# EAGLE design HeadsetR2 (EAGLE 6.5.0)
ECE477 Senior Design Project Augmented Reality Simulator board utilizing STM32F4 and Raspberry PI
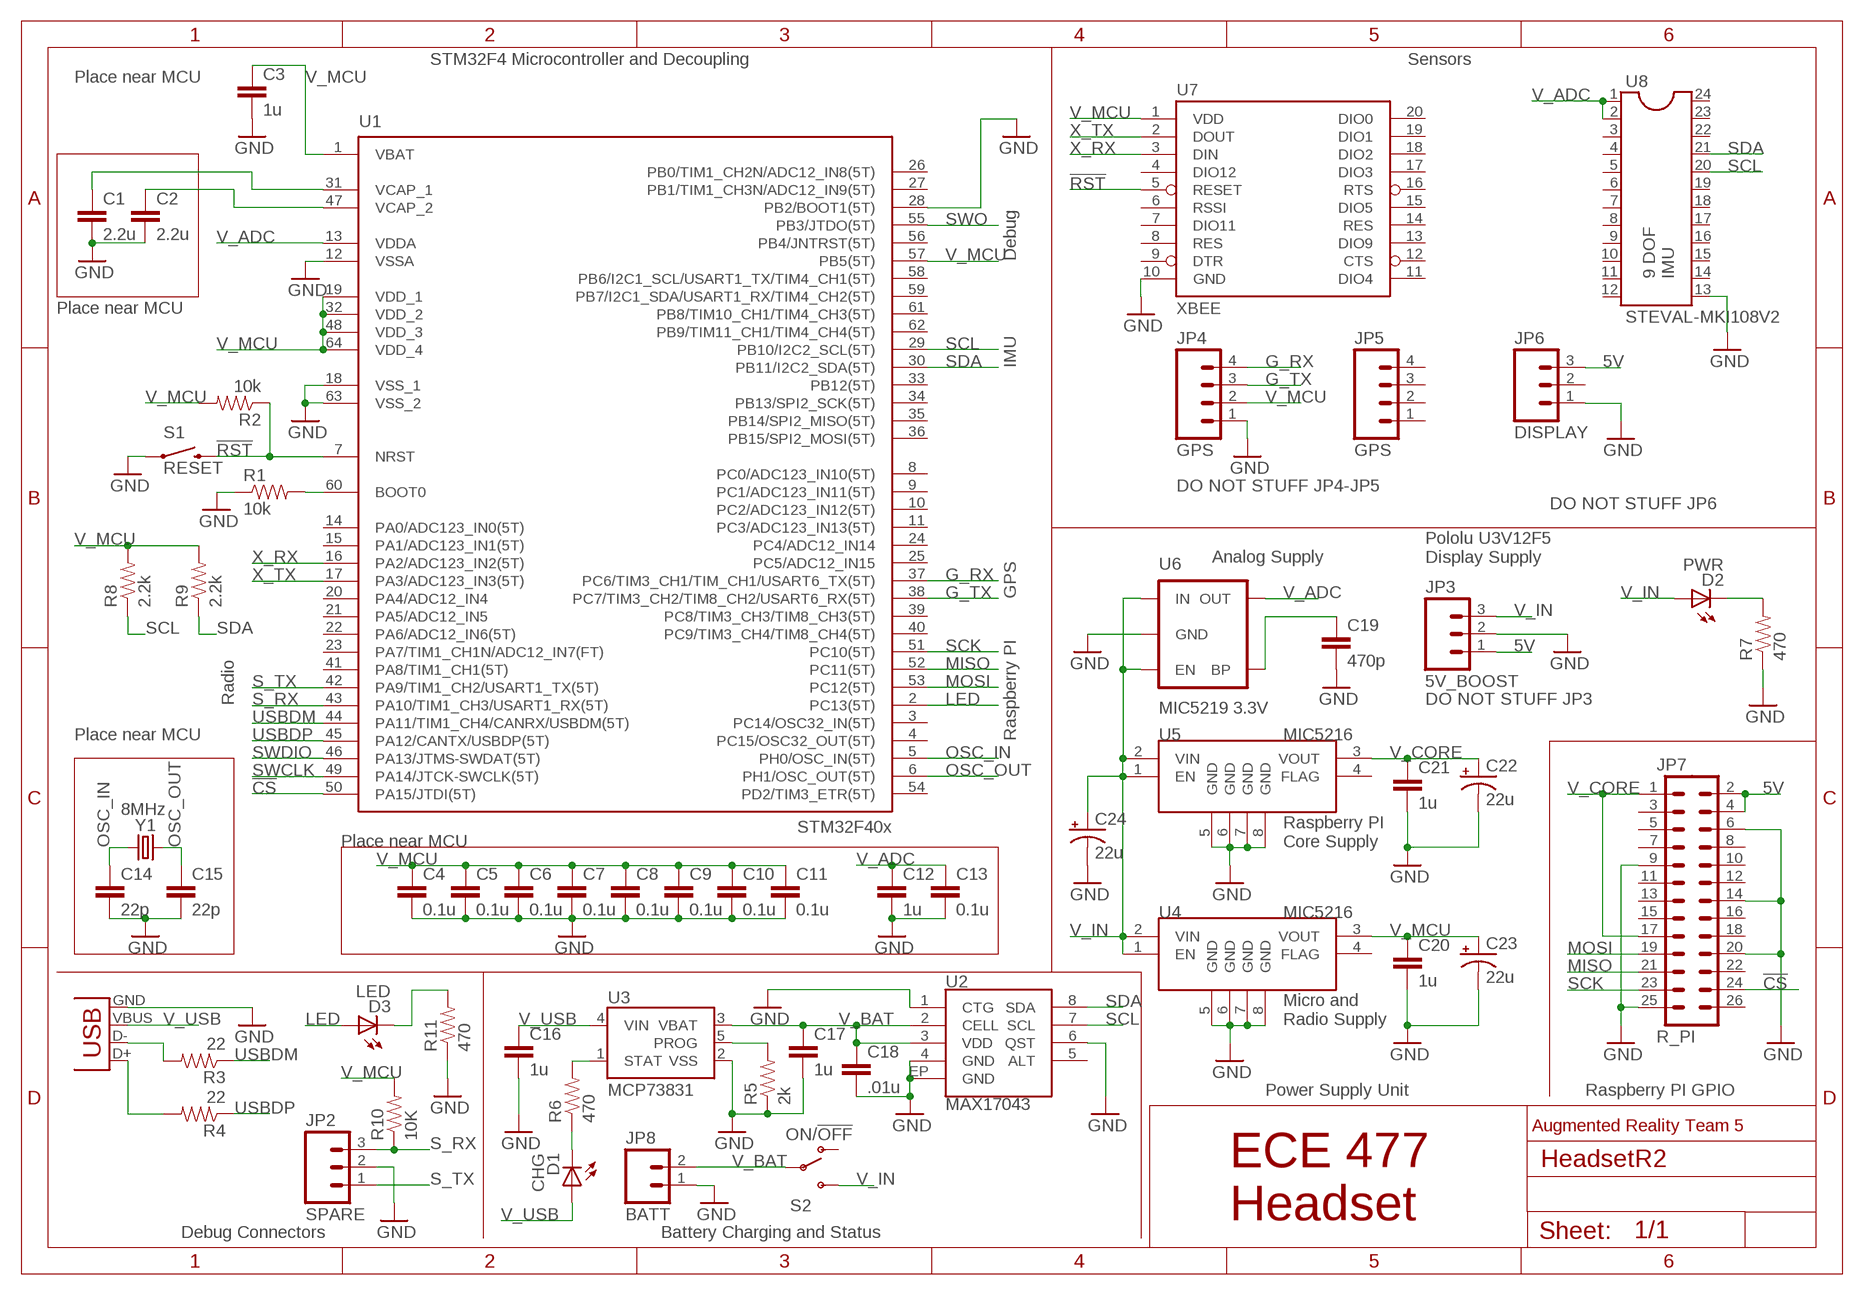
[diagram p0: schematic, sheet 1]

## Parts
C1  2.2u  CAP1206  [1206]
C2  2.2u  CAP1206  [1206]
C3  1u  CAP1206  [1206]
C4  0.1u  CAP1206  [1206]
C5  0.1u  CAP1206  [1206]
C6  0.1u  CAP1206  [1206]
C7  0.1u  CAP1206  [1206]
C8  0.1u  CAP1206  [1206]
C9  0.1u  CAP1206  [1206]
C10  0.1u  CAP1206  [1206]
C11  0.1u  CAP1206  [1206]
C12  1u  CAP1206  [1206]
C13  0.1u  CAP1206  [1206]
C14  22p  CAP1206  [1206]
C15  22p  CAP1206  [1206]
C16  1u  CAP1206  [1206]
C17  1u  CAP1206  [1206]
C18  .01u  CAP1206  [1206]
C19  470p  CAP1206  [1206]
C20  1u  CAP1206  [1206]
C21  1u  CAP1206  [1206]
C22  22u  CAP_POLD  [PANASONIC_D]
C23  22u  CAP_POLD  [PANASONIC_D]
C24  22u  CAP_POLD  [PANASONIC_D]
D1  CHG  LED-RED1206  [LED-1206]
D2  PWR  LED-RED1206  [LED-1206]
D3  LED  LED-RED1206  [LED-1206]
JP1  USBSMD  [USB-MINIB]
JP2  SPARE  M03PTH  [1X03]
JP3  5V_BOOST  M03PTH  [1X03]
JP4  GPS  M04PTH  [1X04]
JP5  GPS  M04PTH  [1X04]
JP6  DISPLAY  M03PTH  [1X03]
JP7  R_PI  M13X22X13  [2X13]
JP8  BATT  M02JST-PTH-2  [JST-2-PTH]
R1  10k  RES1206  [1206]
R2  10k  RES1206  [1206]
R3  22  RES1206  [1206]
R4  22  RES1206  [1206]
R5  2k  RES1206  [1206]
R6  470  RES1206  [1206]
R7  470  RES1206  [1206]
R8  2.2k  RES1206  [1206]
R9  2.2k  RES1206  [1206]
R10  10K  RES1206  [1206]
R11  470  RES1206  [1206]
S1  RESET  SWITCH-MOMENTARY-2PTH  [TACTILE-PTH]
S2  ON/!OFF!  SWITCH-SPDTPTH  [SWITCH-SPDT]
U1  STM32F405RGT6  STM32F405R  [TQFP64]
U2  MAX17043  MAX1704X  [TDFN-8]
U3  MCP73831  [SOT23-5]
U4  MIC5216  V_REG_MIC5216  [MSOP8]
U5  MIC5216  V_REG_MIC5216  [MSOP8]
U6  MIC5219 3.3V  V_REG_MIC52193.3V  [SOT23-5]
U7  XBEE  XBEE-1B1  [XBEE-1]
U8  STEVAL-MKI108V2  DIL24-6  [DIL24-6]
Y1  8MHz  CRYSTALSMD  [HC49UP]

## Nets
5V: JP3.1 JP6.3 JP7.2 JP7.4
!CS!: JP7.24 U1.50(PA15/JTDI(5T))
!RST!: R2.1 S1.3 U1.7(NRST) U7.5(RESET)
BC_PROG: R5.2 U3.5(PROG)
BC_STAT: R6.2 U3.1(STAT)
BC_STAT_LED: D1.C R6.1
BOOT0: R1.2 U1.60(BOOT0)
G_RX: JP4.4 U1.37(PC6/TIM3_CH1/TIM_CH1/USART6_TX(5T))
G_TX: JP4.3 U1.38(PC7/TIM3_CH2/TIM8_CH2/USART6_RX(5T))
GND: C1.2 C2.2 C3.2 C4.2 C5.2 C6.2 C7.2 C8.2 C9.2 C10.2 C11.2 C12.2 C13.2 C14.2 C15.2 C16.2 C17.2 C18.2 C19.2 C20.2 C21.2 C22.- C23.- C24.- JP1.GND JP2.2 JP3.2 JP4.1 JP6.1 JP7.6 JP7.9 JP7.14 JP7.20 JP7.25 JP8.1 R1.1 R5.1 R7.1 R11.1 S1.1 U1.12(VSSA) U1.18(VSS_1) U1.28(PB2/BOOT1(5T)) U1.63(VSS_2) U2.1(CTG) U2.4(GND) U2.6(QST) U2.EP(GND) U3.2(VSS) U4.5(GND) U4.6(GND) U4.7(GND) U4.8(GND) U5.5(GND) U5.6(GND) U5.7(GND) U5.8(GND) U6.2(GND) U7.10(GND) U8.13
LED: D3.A U1.2(PC13(5T))
LED_LED: D3.C R11.2
MISO: JP7.21 U1.52(PC11(5T))
MOSI: JP7.19 U1.53(PC12(5T))
OSC_IN: C14.1 U1.5(PH0/OSC_IN(5T)) Y1.1
OSC_OUT: C15.1 U1.6(PH1/OSC_OUT(5T)) Y1.2
PWR_LED: D2.C R7.2
S_RX: JP2.3 R10.1 U1.43(PA10/TIM1_CH3/USART1_RX(5T))
S_TX: JP2.1 U1.42(PA9/TIM1_CH2/USART1_TX(5T))
SCK: JP7.23 U1.51(PC10(5T))
SCL: R8.1 U1.29(PB10/I2C2_SCL(5T)) U2.7(SCL) U8.20
SDA: R9.1 U1.30(PB11/I2C2_SDA(5T)) U2.8(SDA) U8.21
SWCLK: U1.49(PA14/JTCK-SWCLK(5T))
SWDIO: U1.46(PA13/JTMS-SWDAT(5T))
SWO: U1.55(PB3/JTDO(5T))
USB_D+: JP1.D+ R4.2
USB_D-: JP1.D- R3.2
USBDM: R3.1 U1.44(PA11/TIM1_CH4/CANRX/USBDM(5T))
USBDP: R4.1 U1.45(PA12/CANTX/USBDP(5T))
V_ADC: C12.1 C13.1 U1.13(VDDA) U6.5(OUT) U8.1 U8.2
V_BAT: C17.1 C18.1 JP8.2 S2.2(P) U2.2(CELL) U2.3(VDD) U3.3(VBAT)
V_BYP: C19.1 U6.4(BP)
V_CORE: C21.1 C22.+ JP7.1 JP7.17 U5.3(VOUT)
V_IN: C24.+ D2.A JP3.3 S2.3(S) U4.1(EN) U4.2(VIN) U5.1(EN) U5.2(VIN) U6.1(IN) U6.3(EN)
V_MCU: C3.1 C4.1 C5.1 C6.1 C7.1 C8.1 C9.1 C10.1 C11.1 C20.1 C23.+ JP4.2 R2.2 R8.2 R9.2 R10.2 U1.1(VBAT) U1.19(VDD_1) U1.32(VDD_2) U1.48(VDD_3) U1.57(PB5(5T)) U1.64(VDD_4) U4.3(VOUT) U7.1(VDD)
V_USB: C16.1 D1.A JP1.VBUS U3.4(VIN)
VCAP1: C1.1 U1.31(VCAP_1)
VCAP2: C2.1 U1.47(VCAP_2)
X_RX: U1.16(PA2/ADC123_IN2(5T)) U7.3(DIN)
X_TX: U1.17(PA3/ADC123_IN3(5T)) U7.2(DOUT)
Unconnected: JP5.1 JP5.2 JP5.3 JP5.4 JP6.2 JP7.3 JP7.5 JP7.7 JP7.8 JP7.10 JP7.11 JP7.12 JP7.13 JP7.15 JP7.16 JP7.18 JP7.22 JP7.26 S2.1(O) U1.3(PC14/OSC32_IN(5T)) U1.4(PC15/OSC32_OUT(5T)) U1.8(PC0/ADC123_IN10(5T)) U1.9(PC1/ADC123_IN11(5T)) U1.10(PC2/ADC123_IN12(5T)) U1.11(PC3/ADC123_IN13(5T)) U1.14(PA0/ADC123_IN0(5T)) U1.15(PA1/ADC123_IN1(5T)) U1.20(PA4/ADC12_IN4) U1.21(PA5/ADC12_IN5) U1.22(PA6/ADC12_IN6(5T)) U1.23(PA7/TIM1_CH1N/ADC12_IN7(FT)) U1.24(PC4/ADC12_IN14) U1.25(PC5/ADC12_IN15) U1.26(PB0/TIM1_CH2N/ADC12_IN8(5T)) U1.27(PB1/TIM1_CH3N/ADC12_IN9(5T)) U1.33(PB12(5T)) U1.34(PB13/SPI2_SCK(5T)) U1.35(PB14/SPI2_MISO(5T)) U1.36(PB15/SPI2_MOSI(5T)) U1.39(PC8/TIM3_CH3/TIM8_CH3(5T)) U1.40(PC9/TIM3_CH4/TIM8_CH4(5T)) U1.41(PA8/TIM1_CH1(5T)) U1.54(PD2/TIM3_ETR(5T)) U1.56(PB4/JNTRST(5T)) U1.58(PB6/I2C1_SCL/USART1_TX/TIM4_CH1(5T)) U1.59(PB7/I2C1_SDA/USART1_RX/TIM4_CH2(5T)) U1.61(PB8/TIM10_CH1/TIM4_CH3(5T)) U1.62(PB9/TIM11_CH1/TIM4_CH4(5T)) U2.5(ALT) U4.4(FLAG) U5.4(FLAG) U7.4(DIO12) U7.6(RSSI) U7.7(DIO11) U7.8(RES) U7.9(DTR) U7.11(DIO4) U7.12(CTS) U7.13(DIO9) U7.14(RES) U7.15(DIO5) U7.16(RTS) U7.17(DIO3) U7.18(DIO2) U7.19(DIO1) U7.20(DIO0) U8.3 U8.4 U8.5 U8.6 U8.7 U8.8 U8.9 U8.10 U8.11 U8.12 U8.14 U8.15 U8.16 U8.17 U8.18 U8.19 U8.22 U8.23 U8.24

## Notes on the sheet
- STM32F4 Microcontroller and Decoupling | Sensors
- Place near MCU
- Debug
- 9 DOF
  IMU
- Place near MCU
- IMU
- DO NOT STUFF JP4-JP5
- DO NOT STUFF JP6
- Analog Supply
- Pololu U3V12F5
  Display Supply
- GPS
- Radio | DO NOT STUFF JP3
- Place near MCU | Raspberry PI
- Place near MCU
- Raspberry PI
  Core Supply
- Micro and
  Radio Supply
- Power Supply Unit | Raspberry PI GPIO
- Augmented Reality Team 5
- ECE 477
  Headset
- Debug Connectors | Battery Charging and Status

## Library data of the parts
C1-C21 = ECE477:CAP: Capacitor Standard 0603 ceramic capacitor, and 0.1" leaded capacitor.
C22-C24 = SparkFun-Passives:CAP_POL: Capacitor Polarized These are standard SMD and PTH capacitors. Normally 10uF, 47uF, and 100uF in electrolytic and tantalum varieties. Always verify the external diameter of the through hole cap, it varies with capacity, voltage, and manufacturer. The EIA devices should be standard.
D1-D3 = SparkFun-LED:LED-RED: Assorted Red LEDs LilyPad 1206- DIO-09912 1206- DIO-00809 0603- DIO-00819; PROD_ID: DIO-00809; VALUE: RED
JP1 = SparkFun-Connectors:USB: USB Connectors USB-B-PTH is fully proven SKU : PRT-00139/CONN-08278 USB-miniB is fully proven SKU : PRT-00587 USB-A-PCB is untested. USB-A-H is throughly reviewed, but untested. Spark Fun Electronics SKU : PRT-00437 USB-B-SMT is throughly reviewed, but untested. Needs silkscreen touching up. USB-A-S has not been used/tested USB-MB-H has not been used/tested USB-MICROB has been used. CONN-09505
JP2 JP3 JP6 = SparkFun-Connectors:M03: Header 3 Standard 3-pin 0.1" header. Use with straight break away headers (SKU : PRT-00116), right angle break away headers (PRT-00553), swiss pins (PRT-00743), machine pins (PRT-00117), and female headers (PRT-00115). Molex polarized connector foot print use with SKU : PRT-08232 with associated crimp pins and housings.
JP4 JP5 = SparkFun-Connectors:M04: Header 4 Standard 4-pin 0.1" header. Use with straight break away headers (SKU : PRT-00116), right angle break away headers (PRT-00553), swiss pins (PRT-00743), machine pins (PRT-00117), and female headers (PRT-00115). Molex polarized connector foot print use with SKU : PRT-08231 with associated crimp pins and housings. 1MM SMD Version SKU: PRT-10208
JP7 = SparkFun-Connectors:M13X2: 0.1" spaced headers
JP8 = SparkFun-Connectors:M02: Header 2 Standard 2-pin 0.1" header. Use with straight break away headers (SKU : PRT-00116), right angle break away headers (PRT-00553), swiss pins (PRT-00743), machine pins (PRT-00117), and female headers (PRT-00115). Molex polarized connector foot print use with SKU : PRT-08233 with associated crimp pins and housings.
R1-R11 = ECE477:RES: RESISTOR Surface-mount resistors
S1 = SparkFun-Electromechanical:SWITCH-MOMENTARY-2: Various NO switches- pushbuttons, reed, etc
S2 = SparkFun-Electromechanical:SWITCH-SPDT: SPDT Switch Simple slide switch, Spark Fun Electronics SKU : COM-00102 DPDT SMT slide switch, AYZ0202, SWCH-08179
U1 = ECE477:STM32F405R: STM32F405 64 pin LQFP reviewed: YES tested: YES
U2 = SparkFun-PowerIC:MAX1704X: MAX17043/MAX17044: Battery Fuel Guage (43 is 1cell, 44 is 2cell)
U3 = SparkFun-PowerIC:MCP73831: Miniature single cell, fully integrated Li-Ion, Li-polymer charge management controller http://ww1.microchip.com/downloads/en/DeviceDoc/21984a.pdf IC-09995; PROD_ID: IC-09995
U4 U5 = SparkFun-PowerIC:V_REG_MIC5216: 500mA LDO, MSOP8 for better dissipation
U6 = SparkFun-PowerIC:V_REG_MIC5219: V_REG MIC5219 Standard 500mA LDO voltage regulator in SOT-23 layout. Micrel part MIC5219. BP (by-pass) pin is used to lower output noise with 470pF cap, may be left open.; PROD_ID: VREG-09872
U7 = SparkFun-RF:XBEE-1: Xbee module footprints SMT header is CONN-09042.
U8 = ic-package:DIL24: Dual In Line
Y1 = SparkFun-FreqCtrl:CRYSTAL: Various standard crystals. Proven footprints. Spark Fun Electronics SKU : COM-00534

## Board
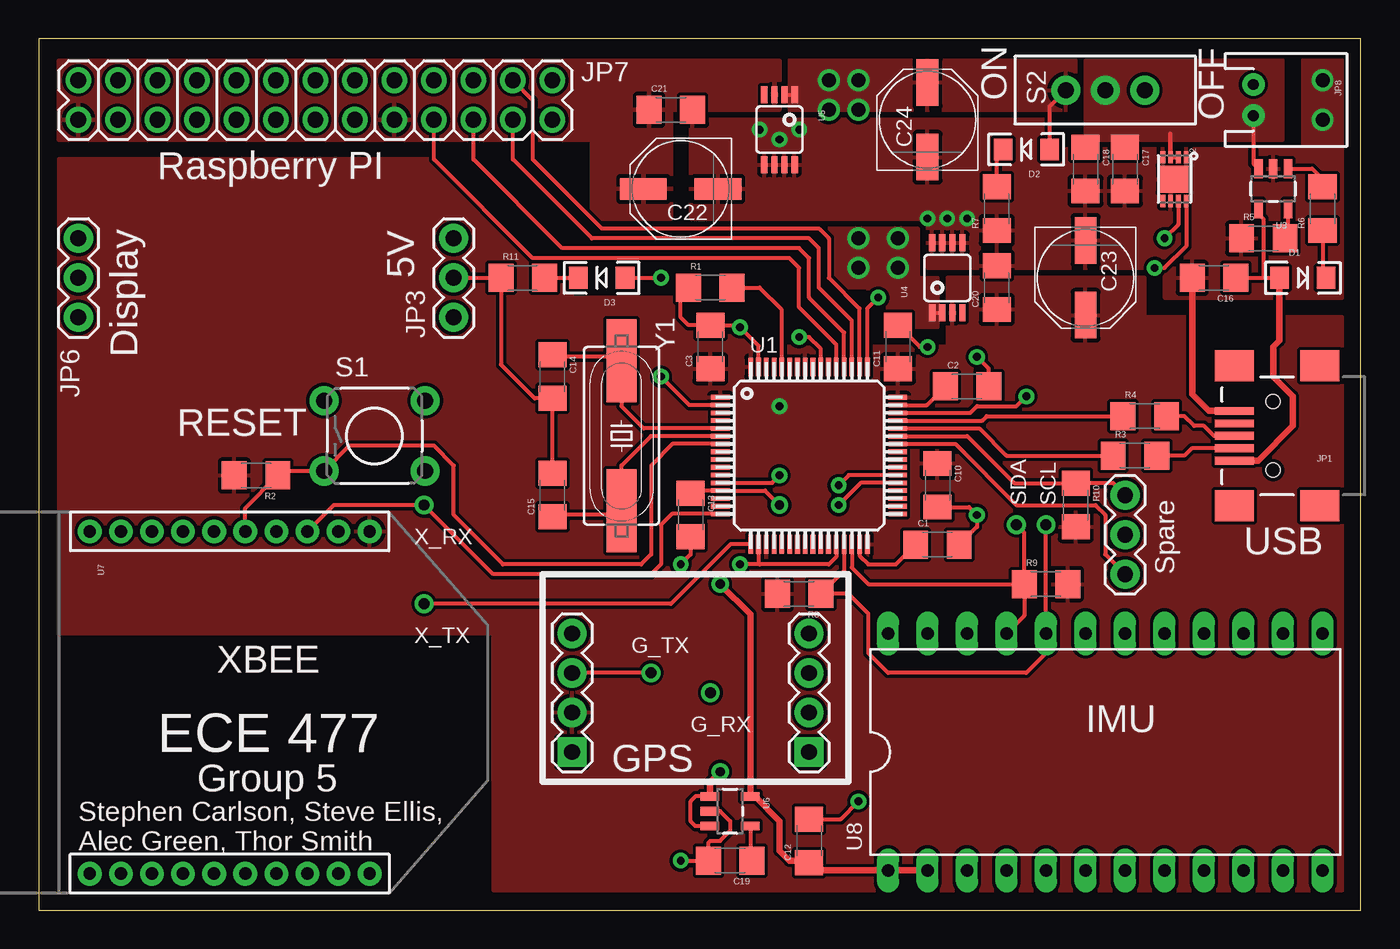
[diagram p1: board, top side]
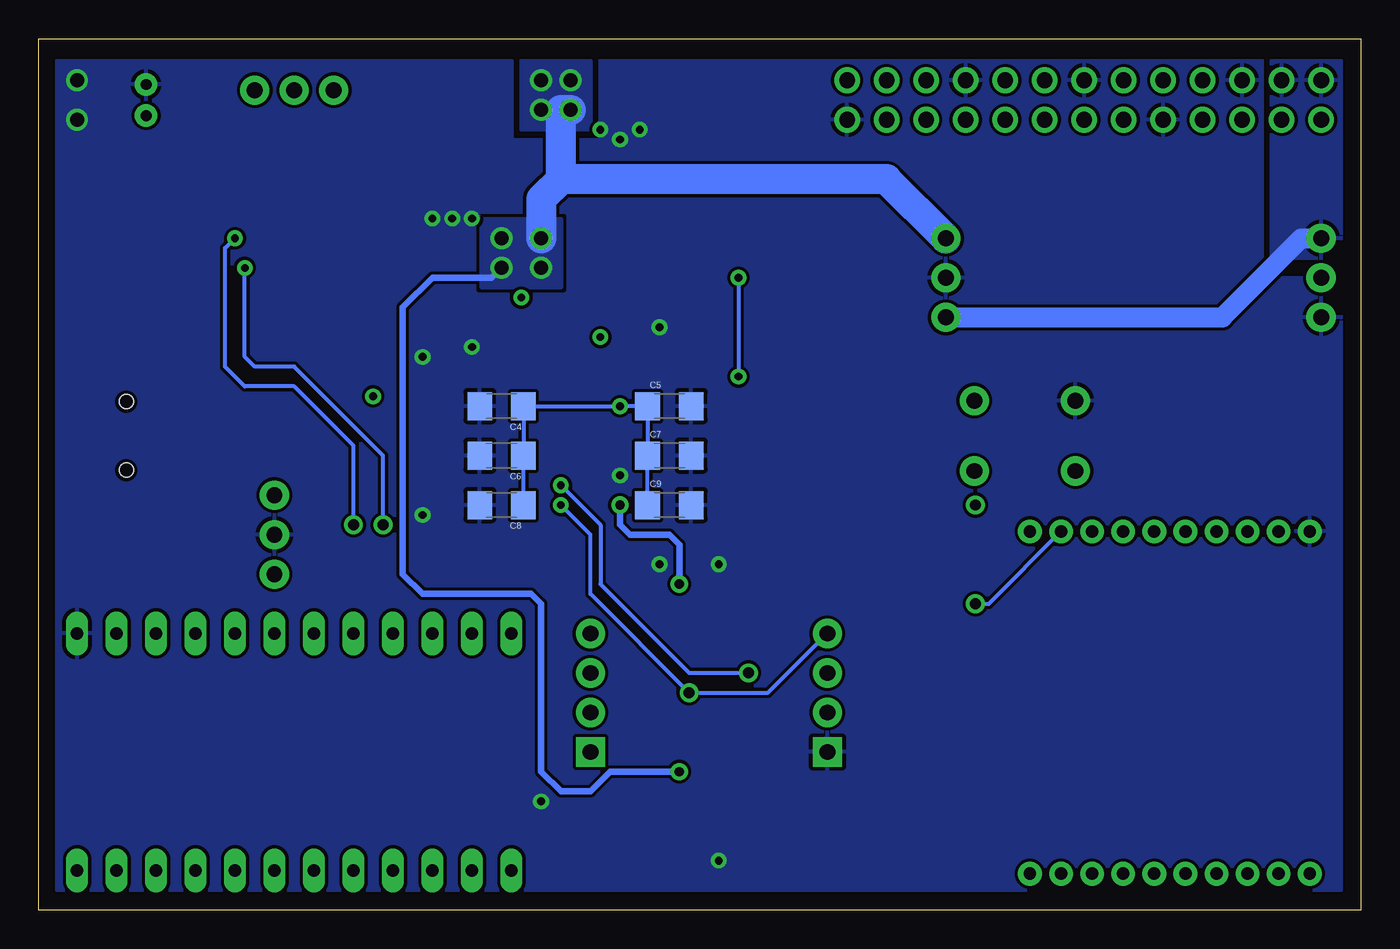
[diagram p2: board, bottom side, seen from below]

Size 85 x 56 mm. Coordinates in mm from the lower left corner, seen from the top.
Outline: 0,0 85,0 85,56 0,56 0,0
Copper layers (1*16): Top 0.035mm / dielectric 1.5mm / Bottom 0.035mm
Design rules "SparkFun *": minimum track width 8mil, minimum drill 15mil, track to track 8mil, track to pad 8mil, pad to pad 8mil, via to via 8mil, smd to smd 8mil, copper to edge 10mil, drill to drill 8mil, minimum pad ring 12mil, minimum via ring 10mil, stop-mask expansion 4mil, vias tented up to drill 25mil, thermal gap 10mil

### Footprints (pad centres in the part's own frame; a part is rotated, then mirrored left to right if it is on the bottom)
1206 = smd 1.6 x 1.8: 1 -1.4,0; 2 1.4,0
PANASONIC_D = smd 3 x 1.4: + 2.4,0; - -2.4,0
LED-1206 = smd 1.2 x 1.4: A -1.5,0; C 1.5,0
USB-MINIB = smd 2.5 x 0.5: D+ 2.5,0; D- 2.5,0.8; GND 2.5,-1.6; ID 2.5,-0.8; VBUS 2.5,1.6 | smd 2.5 x 2: MTN1 -3,4.5; MTN2 2.5,4.5; MTN3 -3,-4.5; MTN4 2.5,-4.5 | hole 0.9: 0,2.2; 0,-2.2
1X03 = drill 1.016 pad 1.88: 1 0,0; 2 2.54,0; 3 5.08,0
1X04 = drill 1.016 pad 1.88 square: 1 0,0 | drill 1.016 pad 1.88: 2 2.54,0; 3 5.08,0; 4 7.62,0
2X13 = drill 1.016 pad 1.651: 1 0,0; 2 0,2.54; 3 2.54,0; 4 2.54,2.54; 5 5.08,0; 6 5.08,2.54; 7 7.62,0; 8 7.62,2.54; 9 10.16,0; 10 10.16,2.54; 11 12.7,0; 12 12.7,2.54; 13 15.24,0; 14 15.24,2.54; 15 17.78,0; 16 17.78,2.54; 17 20.32,0; 18 20.32,2.54; 19 22.86,0; 20 22.86,2.54; 21 25.4,0; 22 25.4,2.54; 23 27.94,0; 24 27.94,2.54; 25 30.48,0; 26 30.48,2.54
JST-2-PTH = drill 0.7 pad 1.448: 1 -1,0; 2 1,0
TACTILE-PTH = drill 1.016 pad 1.88: 1 -3.251,2.261; 2 3.251,2.261; 3 -3.251,-2.261; 4 3.251,-2.261
SWITCH-SPDT = drill 1.016 pad 1.88: 1 0,2.54; 2 0,0; 3 0,-2.54
TQFP64 = smd 1.2 x 0.3: 1 -5.7,3.75; 2 -5.7,3.25; 3 -5.7,2.75; 4 -5.7,2.25; 5 -5.7,1.75; 6 -5.7,1.25; 7 -5.7,0.75; 8 -5.7,0.25; 9 -5.7,-0.25; 10 -5.7,-0.75; 11 -5.7,-1.25; 12 -5.7,-1.75; 13 -5.7,-2.25; 14 -5.7,-2.75; 15 -5.7,-3.25; 16 -5.7,-3.75; 33 5.7,-3.75; 34 5.7,-3.25; 35 5.7,-2.75; 36 5.7,-2.25; 37 5.7,-1.75; 38 5.7,-1.25; 39 5.7,-0.75; 40 5.7,-0.25; 41 5.7,0.25; 42 5.7,0.75; 43 5.7,1.25; 44 5.7,1.75; 45 5.7,2.25; 46 5.7,2.75; 47 5.7,3.25; 48 5.7,3.75 | smd 0.3 x 1.2: 17 -3.75,-5.7; 18 -3.25,-5.7; 19 -2.75,-5.7; 20 -2.25,-5.7; 21 -1.75,-5.7; 22 -1.25,-5.7; 23 -0.75,-5.7; 24 -0.25,-5.7; 25 0.25,-5.7; 26 0.75,-5.7; 27 1.25,-5.7; 28 1.75,-5.7; 29 2.25,-5.7; 30 2.75,-5.7; 31 3.25,-5.7; 32 3.75,-5.7; 49 3.75,5.7; 50 3.25,5.7; 51 2.75,5.7; 52 2.25,5.7; 53 1.75,5.7; 54 1.25,5.7; 55 0.75,5.7; 56 0.25,5.7; 57 -0.25,5.7; 58 -0.75,5.7; 59 -1.25,5.7; 60 -1.75,5.7; 61 -2.25,5.7; 62 -2.75,5.7; 63 -3.25,5.7; 64 -3.75,5.7
TDFN-8 = smd 0.8 x 0.3: 1 -1.4,0.75; 2 -1.4,0.25; 3 -1.4,-0.25; 4 -1.4,-0.75; 5 1.4,-0.75; 6 1.4,-0.25; 7 1.4,0.25; 8 1.4,0.75 | smd 1.73 x 1.88: EP 0,0
SOT23-5 = smd 0.55 x 1.2: 1 -0.95,-1.3; 2 0,-1.3; 3 0.95,-1.3; 4 0.95,1.3; 5 -0.95,1.3
MSOP8 = smd 0.4 x 1.1: 1 -0.975,-2.25; 2 -0.325,-2.25; 3 0.325,-2.25; 4 0.975,-2.25; 5 0.975,2.25; 6 0.325,2.25; 7 -0.325,2.25; 8 -0.975,2.25
XBEE-1 = drill 0.8 pad 1.524: 1 -11,20; 2 -11,18; 3 -11,16; 4 -11,14; 5 -11,12; 6 -11,10; 7 -11,8; 8 -11,6; 9 -11,4; 10 -11,2; 11 11,2; 12 11,4; 13 11,6; 14 11,8; 15 11,10; 16 11,12; 17 11,14; 18 11,16; 19 11,18; 20 11,20
DIL24-6 = drill 0.813 long: 1 -13.97,-7.62; 2 -11.43,-7.62; 3 -8.89,-7.62; 4 -6.35,-7.62; 5 -3.81,-7.62; 6 -1.27,-7.62; 7 1.27,-7.62; 8 3.81,-7.62; 9 6.35,-7.62; 10 8.89,-7.62; 11 11.43,-7.62; 12 13.97,-7.62; 13 13.97,7.62; 14 11.43,7.62; 15 8.89,7.62; 16 6.35,7.62; 17 3.81,7.62; 18 1.27,7.62; 19 -1.27,7.62; 20 -3.81,7.62; 21 -6.35,7.62; 22 -8.89,7.62; 23 -11.43,7.62; 24 -13.97,7.62
HC49UP = smd 5.334 x 1.93: 1 -4.826,0; 2 4.826,0

### Placement (x,y rotation side)
C1  57.78,23.5 0 top
C2  59.69,33.66 0 top
C3  43.18,36.2 90 top
C4  55.24,32.38 180 bottom
C5  44.45,32.38 0 bottom
C6  55.24,29.21 180 bottom
C7  44.45,29.21 0 bottom
C8  55.24,26.04 180 bottom
C9  44.45,26.04 0 bottom
C10  57.78,27.3 270 top
C11  55.24,36.2 90 top
C12  49.53,4.45 90 top
C13  41.91,25.4 270 top
C14  33.02,34.29 270 top
C15  33.02,26.67 90 top
C16  75.56,40.64 180 top
C17  69.85,47.62 270 top
C18  67.31,47.62 270 top
C19  44.45,3.17 180 top
C20  61.59,40.01 90 top
C21  40.64,51.44 0 top
C22  41.27,46.35 180 top
C23  67.31,40.64 270 top
C24  57.15,50.8 90 top
D1  81.28,40.64 0 top
D2  63.5,48.9 180 top
D3  36.2,40.64 180 top
JP1  79.38,30.48 180 top
JP2  69.85,21.59 90 top
JP3  26.67,38.1 90 top
JP4  34.29,10.16 90 top
JP5  49.53,10.16 90 top
JP6  2.54,38.1 90 top
JP7  2.54,50.8 0 top
JP8  78.11,52.07 270 top
R1  43.18,40.01 0 top
R2  13.97,27.94 180 top
R3  70.48,29.21 0 top
R4  71.12,31.75 0 top
R5  78.74,43.18 0 top
R6  82.55,45.09 90 top
R7  61.59,45.09 90 top
R8  48.9,20.32 180 top
R9  64.77,20.95 0 top
R10  66.67,26.04 270 top
R11  31.11,40.64 0 top
S1  21.59,30.48 0 top
S2  68.58,52.7 270 top
U1  49.53,29.21 0 top
U2  73.03,46.99 270 top
U3  79.38,46.35 180 top
U4  58.42,40.64 0 top
U5  47.62,50.16 180 top
U6  44.45,6.35 270 top
U7  1.27,13.34 270 top
U8  68.58,10.16 0 top
Y1  37.47,30.48 270 top

### Tracks (layer width: path | path; a pad name or v marks a point on that pad's centre or on a via)
5V
  Bottom 1.27: JP3.1 8.89,38.1 3.81,43.18 JP6.3
  pour Bottom: 1.27,54.61 1.27,41.91 5.71,41.91 5.71,54.61
!CS!
  Top 0.254: JP7.24 31.75,52.07 31.75,48.26 36.2,43.81 50.16,43.81 50.8,43.18 50.8,40.64 52.78,38.66 U1.50
!RST!
  Top 0.254: U7.5 13.27,25.84 R2.1 15.65,28.22 S1.3 19.96,29.84 25.4,29.84 26.67,28.57 26.67,25.4 29.84,22.23 38.73,22.23 39.37,22.86 39.37,28.57 40.76,29.96 U1.7
BC_PROG
  Top 0.254: U3.5 80.33,43.37 R5.2
BC_STAT
  Top 0.254: U3.1 81.89,47.66 82.55,46.99 R6.2
BC_STAT_LED
  Top 0.254: R6.1 82.55,40.87 D1.C
BOOT0
  Top 0.254: R1.2 46.35,40.01 47.78,38.58 U1.60
G_RX  (via drill 0.5, 0.7)
  Top 0.254: U1.37 52.86,27.46 v51.44,26.04
  Bottom 0.254: v51.44,26.04 49.53,24.13 49.53,20.32 v43.18,13.97 38.1,13.97 JP4.4
G_TX  (via drill 0.5, 0.7)
  Top 0.254: U1.38 52.09,27.96 v51.44,27.3 | v39.37,15.24 JP4.3
  Bottom 0.254: v51.44,27.3 48.9,24.77 48.9,20.95 43.18,15.24 v39.37,15.24
GND  (via drill 0.5, 0.9)
  Top 0.254: U1.63 46.28,36.27 v45.09,37.47 44.95,37.59 C3.2 41.78,37.59 41.27,38.1 41.27,39.5 R1.1 | C15.2 C14.2 31.88,32.89 29.71,35.05 R11.1 JP3.2 | C1.2 60.33,24.64 v60.33,25.4 59.82,25.91 C10.2 | U1.18 46.28,22.3 46.35,22.23 | 55.24,37.47 C11.2 56.65,36.2 v57.15,36.2 | U6.2 43.81,6.35 44.45,5.71 44.45,5.08 43.81,4.45 43.18,4.45 43.05,4.32 C19.2 v41.27,3.17 | C13.2 41.91,22.86 v41.27,22.23 | U1.12 47.15,27.46 v47.62,27.94 | C2.2 61.09,34.8 v60.33,35.56 | U1.28 51.28,22.7 50.8,22.23 46.35,22.23 | 46.35,22.23 v45.09,22.23 | C12.2 51.56,5.84 v52.7,6.99
  Top 0.406: C16.2 74.17,33.15 75.23,32.08 JP1.GND
  other vias: 82.55,50.8 82.55,53.34 46.35,50.16 48.9,50.16 47.62,49.53 57.15,44.45 58.42,44.45 59.69,44.45
  pour Bottom (rank 2): 1.27,40.64 1.27,1.27 83.82,1.27 83.82,54.61 54.61,54.61 54.61,49.53 48.9,49.53 48.9,54.61 6.35,54.61 6.35,40.64
  pour Top: 41.91,50.8 41.91,44.45 57.15,44.45 57.15,41.27 72.39,41.27 72.39,39.37 83.82,39.37 83.82,54.61 81.28,54.61 81.28,48.9 65.41,48.9 65.41,50.8
  pour Top: 34.29,35.56 34.29,25.4 40.64,25.4 40.64,35.56
LED  (via drill 0.5)
  Top 0.254: v40.01,34.29 41.84,32.46 U1.2 | D3.A v40.01,40.64
  Bottom 0.254: v40.01,40.64 v40.01,34.29
LED_LED
  Top 0.254: R11.2 D3.C
MISO
  Top 0.254: U1.52 51.78,37.12 49.53,39.37 49.53,41.91 48.9,42.55 33.66,42.55 27.94,48.26 JP7.21
MOSI
  Top 0.254: U1.53 51.28,36.35 48.9,38.73 48.9,41.27 48.26,41.91 31.75,41.91 25.4,48.26 JP7.19
OSC_IN
  Top 0.254: U1.5 38.89,30.96 37.47,32.38 Y1.1 37.21,35.56 33.15,35.56 C14.1
OSC_OUT
  Top 0.254: U1.6 39.35,30.46 37.47,28.57 Y1.2 37.21,25.4 33.15,25.4 C15.1
PWR_LED
  Top 0.254: R7.2 61.59,48.49 D2.C
S_RX
  Top 0.254: U1.43 59.71,30.46 62.73,27.43 R10.1 69.08,27.43 JP2.3
S_TX
  Top 0.254: U1.42 58.94,29.96 62.87,26.04 67.94,26.04 68.58,25.4 68.58,22.86 JP2.1
SCK
  Top 0.254: U1.51 52.28,37.89 50.16,40.01 50.16,42.55 49.53,43.18 35.56,43.18 30.48,48.26 JP7.23
SCL  (via drill 0.5, 0.7)
  Top 0.254: U1.29 51.78,21.8 R8.1 52.07,20.32 53.34,19.05 53.34,16.51 54.61,15.24 63.5,15.24 64.77,16.51 U8.20 v64.77,24.77 | U2.7 73.28,44.06 v72.39,43.18
  Bottom 0.254: v64.77,24.77 64.77,29.84 68.58,33.66 71.75,33.66 73.03,34.92 73.03,42.55 v72.39,43.18
SDA  (via drill 0.5, 0.7)
  Top 0.254: U1.30 52.28,22.02 53.34,20.95 R9.1 | U2.8 73.78,42.66 72.39,41.27 v71.75,41.27 | R9.1 63.37,24.26 v62.87,24.77 | R9.1 63.37,18.92 U8.21
  Bottom 0.254: v62.87,24.77 62.87,29.21 68.58,34.92 71.12,34.92 71.75,35.56 v71.75,41.27
SWCLK  (via drill 0.5)
  Top 0.254: U1.49 53.28,38.67 v53.98,39.37
SWDIO  (via drill 0.5)
  Top 0.254: U1.46 59.9,31.96 60.33,32.38 62.87,32.38 v63.5,33.02
SWO  (via drill 0.5)
  Top 0.254: U1.55 50.28,36.08 49.53,36.83 v48.9,36.83
USB_D+
  Top 0.254: JP1.D+ 75.56,30.48 74.93,31.11 74.3,31.11 73.66,31.75 R4.2
USB_D-
  Top 0.254: JP1.D- 74.13,29.68 73.66,29.21 R3.2
USBDM
  Top 0.254: U1.44 60.48,30.96 62.23,29.21 R3.1
USBDP
  Top 0.254: U1.45 60.67,31.46 60.96,31.75 R4.1
V_ADC  (via drill 0.6)
  Top 0.254: C13.1 42.07,26.96 U1.13 46.7,26.96 v47.62,26.04 | 49.4,3.17 C12.1
  Top 0.406: U8.2 U8.1 50.03,2.54 C12.1 | 49.4,3.17 48.26,3.17 47.62,3.81 47.62,5.71 46.04,7.3 U6.5 45.75,19.02 v43.81,20.95
  Bottom 0.406: v43.81,20.95 43.81,23.5 44.45,24.13 46.99,24.13 47.62,24.77 v47.62,26.04
V_BAT
  Top 0.254: JP8.2 78.11,47.98 U3.3
  Top 0.305: U2.2 U2.3 72.78,49.91
  pour Top (no thermals): 67.31,54.61 67.31,49.53 80.01,49.53 80.01,54.61
V_BYP
  Top 0.254: U6.4 45.75,3.27 C19.1
V_CORE
  pour Top: 1.27,54.61 1.27,49.53 35.56,49.53 35.56,44.45 40.64,44.45 40.64,51.44 47.62,51.44 47.62,54.61
V_IN  (via drill 0.6, 0.9)
  Top 0.254: U5.2 U5.1 | U4.1 U4.2 | U6.3 42.23,5.4 41.91,5.71 41.91,6.99 42.23,7.3 U6.1 | D2.A 65,51.66 S2.3
  Top 0.406: U6.1 43.15,8.22 v43.81,8.89
  Bottom 0.406: v43.81,8.89 48.26,8.89 49.53,7.62 51.44,7.62 52.7,8.89 52.7,19.68 53.34,20.32 60.33,20.32 61.59,21.59 61.59,38.73 59.69,40.64 55.88,40.64 v55.24,41.27
  Bottom 1.93: JP3.3 30.48,46.99 51.44,46.99 | 51.44,46.99 51.44,51.44 v50.8,51.44 | 51.44,46.99 52.7,45.72 v52.7,43.18
  other vias: 50.8,53.34 52.7,53.34 52.7,51.44 55.24,43.18 52.7,41.27
  pour Top: 48.26,54.61 48.26,51.44 66.67,51.44 66.67,54.61
  pour Top (no thermals): 48.26,54.61 48.26,51.44 50.16,51.44 50.16,54.61
  pour Bottom: 49.53,54.61 49.53,50.16 53.98,50.16 53.98,54.61
  pour Top (no thermals): 57.78,40.64 57.78,37.47 53.34,37.47 53.34,40.01 50.8,40.01 50.8,43.81 56.52,43.81 56.52,40.64
  pour Bottom: 51.44,44.45 51.44,40.01 56.52,40.01 56.52,44.45
V_MCU  (via drill 0.5)
  Bottom 0.254: C9.1 C7.1 C5.1 v47.62,32.38 C4.1 C6.1 C8.1
  pour Top (rank 2): 1.27,48.26 1.27,17.78 29.21,17.78 29.21,1.27 83.82,1.27 83.82,38.1 71.12,38.1 71.12,40.64 58.42,40.64 58.42,36.2 52.7,36.2 52.7,39.37 34.29,39.37 34.29,48.26
V_USB
  Top 0.254: U3.4 78.42,44.77 78.74,44.45 78.74,40.64 | C16.1 78.74,40.64 | 78.74,40.64 D1.A
  Top 0.406: JP1.VBUS 78.41,28.88 80.64,31.11 80.64,33.02 79.38,34.29 79.38,36.2 79.78,36.6 D1.A
VCAP1
  Top 0.254: U1.31 52.78,22.79 53.34,22.23 55.12,22.23 C1.1
VCAP2
  Top 0.254: U1.47 57.09,32.46 C2.1
X_RX  (via drill 0.7)
  Top 0.254: U1.16 40.7,25.46 40.01,24.77 40.01,22.23 39.37,21.59 29.21,21.59 v24.77,26.04 18.97,26.04 U7.3
X_TX  (via drill 0.7)
  Top 0.254: U1.17 44.47,23.51 40.64,19.68 v24.77,19.68
  Bottom 0.254: v24.77,19.68 23.92,19.68 U7.2

### Text on the board
tPlace: ON | OFF | Raspberry PI | 5V | Display | RESET | SDA | SCL | X_RX | USB | Spare | X_TX | G_TX | XBEE | G_RX | IMU | ECE 477 | GPS | Group 5 | Stephen Carlson, Steve Ellis, / Alec Green, Thor Smith